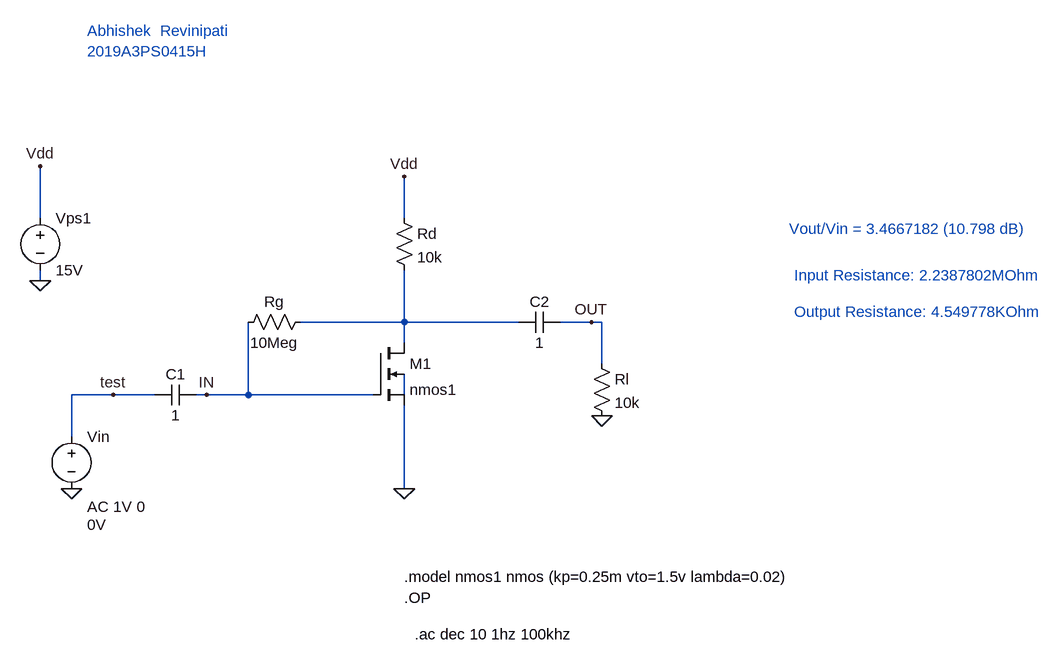
[diagram p0: schematic 2019A3PS0415H_Exp8_1.asc]
2019A3PS0415H_Exp8_1.asc, the LTspice schematic file:
Version 4
SHEET 1 2068 680
WIRE 496 -352 496 -432
WIRE 1056 -352 1056 -416
WIRE 496 -256 496 -272
WIRE 1056 -192 1056 -272
WIRE 1056 -192 896 -192
WIRE 1232 -192 1056 -192
WIRE 1344 -192 1296 -192
WIRE 1360 -192 1344 -192
WIRE 1056 -160 1056 -192
WIRE 1360 -128 1360 -192
WIRE 608 -80 544 -80
WIRE 672 -80 608 -80
WIRE 752 -80 736 -80
WIRE 816 -80 816 -192
WIRE 816 -80 752 -80
WIRE 1008 -80 816 -80
WIRE 1056 -80 1056 -112
WIRE 544 -16 544 -80
WIRE 1056 64 1056 -64
FLAG 1056 64 0
FLAG 1360 -48 0
FLAG 544 64 0
FLAG 496 -256 0
FLAG 496 -432 Vdd
FLAG 1056 -416 Vdd
FLAG 1344 -192 OUT
FLAG 752 -80 IN
FLAG 608 -80 test
SYMBOL voltage 496 -368 R0
WINDOW 123 0 0 Left 0
WINDOW 39 0 0 Left 0
SYMATTR InstName Vps1
SYMATTR Value 15V
SYMBOL voltage 544 -32 R0
WINDOW 3 24 152 Left 2
WINDOW 123 24 124 Left 2
WINDOW 39 0 0 Left 0
SYMATTR Value 0V
SYMATTR Value2 AC 1V 0
SYMATTR InstName Vin
SYMBOL cap 736 -96 R90
WINDOW 0 0 32 VBottom 2
WINDOW 3 32 32 VTop 2
SYMATTR InstName C1
SYMATTR Value 1
SYMBOL cap 1296 -208 R90
WINDOW 0 0 32 VBottom 2
WINDOW 3 32 32 VTop 2
SYMATTR InstName C2
SYMATTR Value 1
SYMBOL res 1040 -368 R0
SYMATTR InstName Rd
SYMATTR Value 10k
SYMBOL res 912 -208 R90
WINDOW 0 0 56 VBottom 2
WINDOW 3 32 56 VTop 2
SYMATTR InstName Rg
SYMATTR Value 10Meg
SYMBOL res 1344 -144 R0
SYMATTR InstName Rl
SYMATTR Value 10k
SYMBOL nmos4 1008 -160 R0
SYMATTR InstName M1
SYMATTR Value nmos1
SYMATTR Value2 l=10u w=10u
TEXT 1056 200 Left 2 !.model nmos1 nmos (kp=0.25m vto=1.5v lambda=0.02)
TEXT 1056 232 Left 2 !.OP
TEXT 1072 288 Left 2 !.ac dec 10 1hz 100khz
TEXT 1648 -336 Left 2 ;Vout/Vin = 3.4667182 (10.798 dB)
TEXT 1656 -264 Left 2 ;Input Resistance: 2.2387802MOhm
TEXT 1656 -208 Left 2 ;Output Resistance: 4.549778KOhm
TEXT 568 -640 Left 2 ;Abhishek  Revinipati\n2019A3PS0415H

The netlist it stands for:
* 2019A3PS0415H_Exp8_1.asc
Vps1 Vdd 0 15V
Vin test 0 0V AC 1V 0
C1 IN test 1
C2 OUT N001 1
Rd Vdd N001 10k
Rg N001 IN 10Meg
Rl OUT 0 10k
M1 N001 IN 0 N002 nmos1 l=10u w=10u
.model NMOS NMOS
.model PMOS PMOS
.lib standard.mos
.model nmos1 nmos (kp=0.25m vto=1.5v lambda=0.02)
.OP
.ac dec 10 1hz 100khz
* Vout/Vin = 3.4667182 (10.798 dB)
* Input Resistance: 2.2387802MOhm
* Output Resistance: 4.549778KOhm
* Abhishek  Revinipati
* 2019A3PS0415H
.backanno
.end